# EAGLE design 0350_2Dot8inchLCDRev010002 (EAGLE 9.6.2)
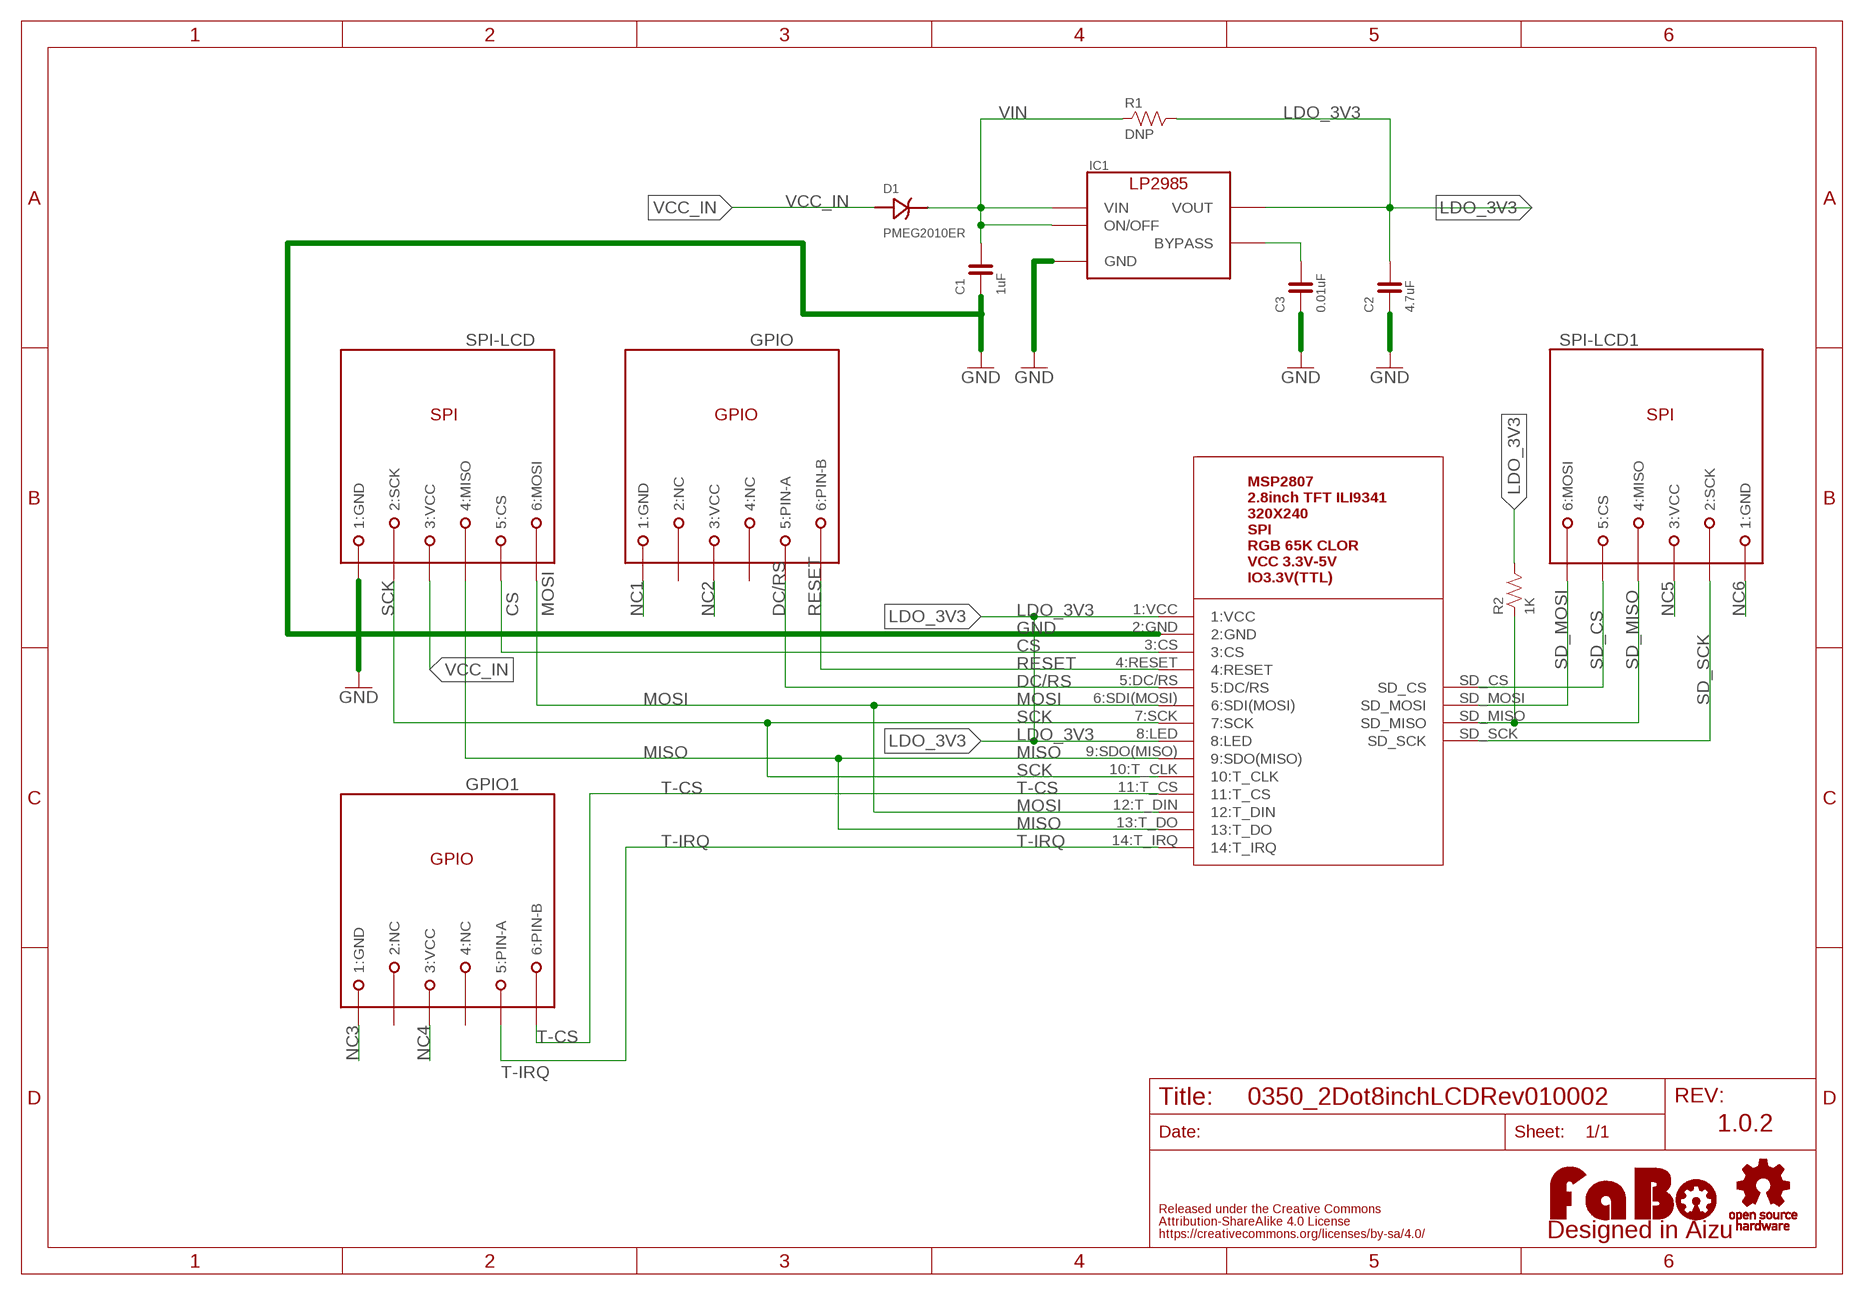
[diagram p0: schematic, sheet 1]

## Parts
C1  1uF  CAPACITOR-0603  [0603]
C2  4.7uF  CAPACITOR-0603  [0603]
C3  0.01uF  CAPACITOR-0603  [0603]
D1  PMEG2010ER  [SOD123W]
GPIO  MODULAR-JACK-6P-RJ11_GPIO  [7002-6PXC-X]
GPIO1  MODULAR-JACK-6P-RJ11_GPIO  [7002-6PXC-X]
IC1  LP2985-33DBV  [SOT-23-5]
LOGO1  LOGO_FABO-M_BOTTOM  [LOGO_FABO_M_BOTTOM]
R1  DNP  RESISTOR-0805  [0805]
R2  1K  RESISTOR-0805  [0805]
SPI-LCD  MODULAR-JACK-6P-RJ11_SPI  [7002-6PXC-X]
SPI-LCD1  MODULAR-JACK-6P-RJ11_SPI  [7002-6PXC-X]
U$3  LOGO_OSHW-M_BOTTOM  [LOGO_OSHW_M_BOTTOM]
U$6  MSP2807(LCD_SPI_WITH_SDCARD  [SPI_LCD_MSP2807]

## Nets
CS: SPI-LCD.5(5:CS) U$6.3:CS
DC/RS: GPIO.5(5:PIN-A) U$6.5:DC/RS
GND: C1.1 C2.1 C3.1 IC1.2(GND) SPI-LCD.1(1:GND) U$6.2:GND
LDO_3V3: C2.2 IC1.5(VOUT) R1.2 R2.2 U$6.1:VCC U$6.8:LED
MISO: SPI-LCD.4(4:MISO) U$6.9:SDO(MISO) U$6.13:T_DO
MOSI: SPI-LCD.6(6:MOSI) U$6.6:SDI(MOSI) U$6.12:T_DIN
N$2: C3.2 IC1.4(BYPASS)
NC1: GPIO.1(1:GND)
NC2: GPIO.3(3:VCC)
NC3: GPIO1.1(1:GND)
NC4: GPIO1.3(3:VCC)
NC5: SPI-LCD1.3(3:VCC)
NC6: SPI-LCD1.1(1:GND)
RESET: GPIO.6(6:PIN-B) U$6.4:RESET
SCK: SPI-LCD.2(2:SCK) U$6.7:SCK U$6.10:T_CLK
SD_CS: SPI-LCD1.5(5:CS) U$6.SD_CS
SD_MISO: R2.1 SPI-LCD1.4(4:MISO) U$6.SD_MISO
SD_MOSI: SPI-LCD1.6(6:MOSI) U$6.SD_MOSI
SD_SCK: SPI-LCD1.2(2:SCK) U$6.SD_SCK
T-CS: GPIO1.6(6:PIN-B) U$6.11:T_CS
T-IRQ: GPIO1.5(5:PIN-A) U$6.14:T_IRQ
VCC_IN: D1.2(ANODE) SPI-LCD.3(3:VCC)
VIN: C1.2 D1.1(CATHODE) IC1.1(VIN) IC1.3(ON/OFF) R1.1
Unconnected: GPIO1.2(2:NC) GPIO1.4(4:NC) GPIO.2(2:NC) GPIO.4(4:NC)

## Notes on the sheet
- 1.0.2

## Library data of the parts
C1-C3 = FaBo-Capacitor:CAPACITOR: CAPACITOR
D1 = FaBo-Diode:PMEG2010ER
GPIO GPIO1 = FaBo-Connetor:MODULAR-JACK-6P-RJ11_GPIO
IC1 = FaBo-Supply:LP2985: LP2985
LOGO1 = component:LOGO_FABO
R1 R2 = FaBo-Resistors:RESISTOR: RESISTOR
SPI-LCD SPI-LCD1 = FaBo-Connetor:MODULAR-JACK-6P-RJ11_SPI
U$3 = component:LOGO_OSHW
U$6 = FaBo-Boards:MSP2807(LCD_SPI_WITH_SDCARD

## Board
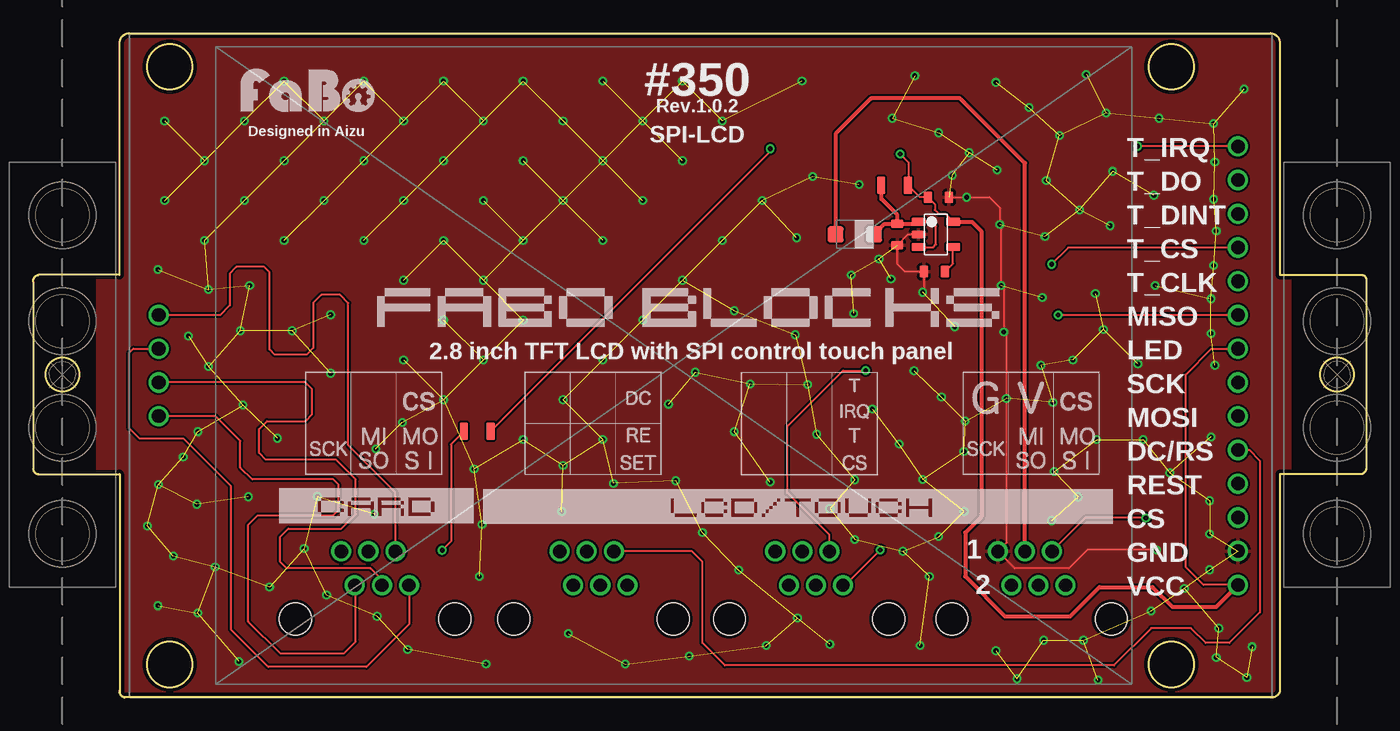
[diagram p1: board, top side]
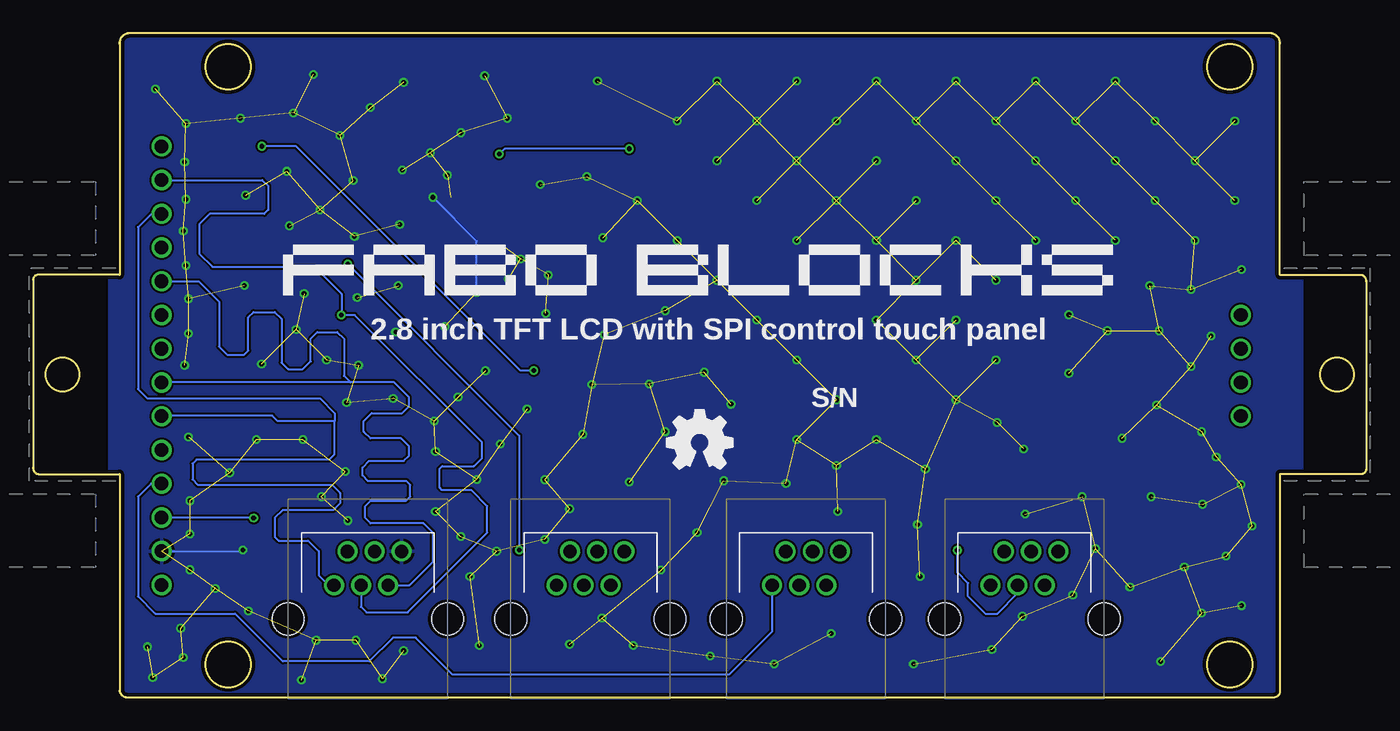
[diagram p2: board, bottom side, seen from below]

Size 100.41 x 50.01 mm. Coordinates in mm from the lower left corner, seen from the top.
Outline: 7.2,50.01 93.2,50.01 arc-90 93.9,49.21 93.9,31.81 100.1,31.81 arc-90 100.4,31.41 100.4,17.31 arc-90 100,16.81 93.9,16.81 93.9,0.51 arc-90 93.2,0.01 6.9,0.01 arc-90 6.5,0.51 6.5,16.81 0.4,16.81 arc-90 0,17.21 0,31.31 arc-90 0.4,31.81 6.5,31.81 6.5,49.21 arc-90 7.2,50.01
Outline: circle at 98.2,24.31 radius 1.27
Outline: circle at 2.2,24.31 radius 1.27
Copper layers (1*16): Top 0.035mm / dielectric 1.6mm / Bottom 0.035mm
Design rules "PCBway": minimum track width 6mil, minimum drill 12mil, track to track 6mil, track to pad 6mil, pad to pad 6mil, via to via 6mil, smd to smd 6mil, copper to edge 10mil, drill to drill 10mil, minimum pad ring 10mil, minimum via ring 6mil, stop-mask expansion 2mil, vias tented up to drill 100mil, thermal gap 8mil
tRestrict: area -1.2,15.6 to 4.7,32.7; area 94.8,15.8 to 100.7,32.9
bRestrict: area -1.2,15.6 to 4.7,32.7; area 94.8,15.8 to 100.7,32.9

### Footprints (pad centres in the part's own frame; a part is rotated, then mirrored left to right if it is on the bottom)
0603 = smd 0.65 x 0.9: 1 -0.8,0; 2 0.8,0
SOD123W = smd 1.2 x 1.2: 1 -1.45,0; 2 1.45,0
7002-6PXC-X = drill 1: 1 2.55,5.08; 2 1.53,2.54; 3 0.51,5.08; 4 -0.51,2.54; 5 -1.53,5.08; 6 -2.55,2.54 | hole 2.4: -6,0; 6,0
SOT-23-5 = smd 0.6 x 1.05: 1 -0.95,-1.3; 2 0,-1.3; 3 0.95,-1.3; 4 0.95,1.3; 5 -0.95,1.3
0805 = smd 0.6 x 1.3: 1 -1,0; 2 1,0
SPI_LCD_MSP2807 = drill 1.02: 1:VCC 0,-16.51; 2:GND 0,-13.97; 3:CS 0,-11.43; 4:RESET 0,-8.89; 5:DC/RS 0,-6.35; 6:SDI(MOSI) 0,-3.81; 7:SCK 0,-1.27; 8:LED 0,1.27; 9:SDO(MISO) 0,3.81; 10:T_CLK 0,6.35; 11:T_CS 0,8.89; 12:T_DIN 0,11.43; 13:T_DO 0,13.97; 14:T_IRQ 0,16.51; SD_CS -81.28,3.81; SD_MISO -81.28,-1.27; SD_MOSI -81.28,1.27; SD_SCK -81.28,-3.81

### Placement (x,y rotation side)
C1  65.08,34.86 90 top
C2  68.18,37.66 180 top
C3  67.88,32.06 0 top
D1  61.88,34.86 180 top
GPIO  42.2,5.91 0 bottom
GPIO1  58.44,5.91 0 bottom
IC1  67.98,34.86 270 top
LOGO1  20.67,43.71 0 bottom
R1  64.88,38.56 0 top
R2  33.45,20.04 0 top
SPI-LCD  75.2,5.91 0 bottom
SPI-LCD1  25.75,5.91 0 bottom
U$2  [4-1BLOCK]  2.2,24.31 0 top
U$3  50.2,19.19 0 top
U$4  [4-1BLOCK]  98.2,24.31 180 top
U$6  90.73,24.98 0 top

### Tracks (layer width: path | path; a pad name or v marks a point on that pad's centre or on a via)
CS  (via drill 0.35)
  Top 0.152: v83.8,13.51 79.25,13.51 SPI-LCD.5
  Bottom 0.152: U$6.3:CS 83.85,13.55 v83.8,13.51
DC/RS
  Top 0.152: U$6.5:DC/RS 91.58,18.63 92.4,17.81 92.4,6.41 90.1,4.11 88.3,4.11 87.2,5.21 84.2,5.21 81.4,2.41 52.1,2.41 50.4,4.11 50.4,10.21 49.62,10.99 GPIO.5
GND  (via drill 0.35)  (185 unrouted)
  Top 0.152: IC1.2 65.88,34.86 C1.1 65.08,32.63 65.65,32.06 C3.1 67.08,30.59 v67,30.51 | C2.1 v70.3,37.66 72,37.66 72.8,36.86 v72.8,35.61 72.9,35.51 v72.9,31.01 73.1,30.81 v73.1,27.51 73.3,27.31 v73.3,22.51 73.3,11.64 SPI-LCD.1 73.93,9.71 78,9.71 79.4,11.11 v84.6,11.11
  Bottom 0.152: U$6.2:GND 84.7,11.01 v84.6,11.11 | v67,30.51 67,34.36 v70.3,37.66
  other vias: 88.6,12.31 88.6,9.61 88.6,14.81 86.7,8.21 84.2,6.51 91.8,3.81 89.1,3.01 91.4,1.51 88.7,19.61 80.1,19.41 76.8,22.21 76.9,17.01 76.7,13.31 78.7,15.11 85.6,16.91 83.6,19.41 70.1,14.01 68.2,12.11 70.1,18.51 67,16.41 65.5,11.01 67.5,9.11 76.1,4.31 79.1,4.31 72.5,3.51 74.1,1.41 80.2,1.31 89.3,5.21 88.7,27.41 84.5,31.01 80,30.41 80.6,27.71 83.2,25.11 78.3,25.41 75.9,25.01 70.2,20.81 68.4,22.61 76,30.11 61.88,16.38 60,14.21 59,19.81 63.2,21.71 69.4,27.91 76.2,34.71 81.3,39.61 81.1,35.51 84.4,37.81 89,40.31 88.9,37.51 89.1,35.11 88.9,43.21 91.2,45.81 84.8,43.61 13.2,24.91 11.3,18.11 8.6,12.91 13.7,9.81 9.4,6.91 15.5,2.71 25.7,13.81 25.8,18.71 44.6,2.51 49.4,3.11 55.2,3.91 60,4.01 9.9,43.41 12.9,40.41 9.9,37.41 12.9,34.41 15.9,37.41 30.9,40.41 27.9,43.41 30.9,46.41 33.9,43.41 36.9,46.41 39.9,43.41 42.9,46.41 45.9,43.41 48.9,46.41 51.9,43.41 57.9,46.41 42.9,40.41 48.9,40.41 36.9,40.41 24.9,46.41 21.9,43.41 18.9,46.41 15.9,43.41 33.9,37.41 39.9,37.41 45.9,37.41 36.9,34.41 42.9,34.41 27.9,37.41 24.9,40.41 21.9,37.41 18.9,40.41 24.9,34.41 30.9,34.41 18.9,34.41 27.9,31.41 30.9,28.41 27.9,25.41 33.9,31.41 33.9,25.41 36.9,28.41 30.9,22.41 42.9,25.41 39.9,22.41 47.85,22.08 36.9,19.41 42.9,19.41 45.9,28.41 48.9,31.41 51.9,34.41 54.9,37.41 33.8,13.01 48.4,16.31 54,23.61 57.4,27.31 52.8,29.11 57.5,34.61 61.8,28.91 61.6,31.81 58.7,39.21 64.7,43.61 62.2,38.61 68.2,42.51 72.6,39.71 66.4,46.81 72.5,46.31 79.3,46.91 77.3,42.31 75,44.41 76.3,38.91 78.8,36.71 55.5,16.21 52.8,20.01 50.4,12.41 39.8,14.01 28.2,3.61 33.6,9.11 15.8,22.01 12.4,20.01 11.7,27.21 15.6,27.61 22.4,28.81 18.4,19.51 17.8,8.31 21.4,15.11 22.1,7.71 25.9,6.11 22.4,24.41 33.2,17.21 89,25.01 88.9,32.51 88.7,30.01 43.7,16.11 80.8,44.01 63.7,33.01 64.6,31.51 69.2,39.31 70.5,41.01 66.8,3.91 20.4,11.21 16.2,15.11 9.4,32.21 13.2,30.71 19.5,27.61 16.3,31.01 27.8,20.71 40.3,4.81 34.1,2.51 65.21,19.08 49.88,24.48 58.33,23.56 61.88,11.9 57.56,5.97 53.14,9.59 10.56,10.64 12.32,14.54 9.43,16.03 12.4,6.35 39.91,17.47 66.34,24.59
  pour Bottom (rank 6): -12.1,-7.79 108,-7.79 108,59.61 -12.1,59.61
  pour Top (rank 6): -7.2,-5.39 105.5,-5.39 105.5,57.11 -7.2,57.11
LDO_3V3  (via drill 0.35)
  Top 0.152: U$6.1:VCC 88.14,8.47 86.8,9.81 86.8,24.31 88.75,26.25 U$6.8:LED | 69.38,35.91 69.29,35.82 | 69.29,35.82 IC1.5 | v55.5,41.31 55.49,41.31 55.49,41.09 R2.2 | 69.29,35.82 68.7,36.41 68.2,36.41 67.9,36.71 67.9,37.14 C2.2 66.78,37.66 R1.2 65.9,38.58 65.9,40.31 v65.3,40.91 | 69.29,35.82
  Top 0.305: IC1.5 70.7,35.81 71.4,35.11 71.4,13.61 70.2,12.41 70.2,9.11 73.2,6.11 78.1,6.11 80.3,8.31 84.3,8.31 85.8,6.81 89.1,6.81 90.73,8.44 U$6.1:VCC
  Bottom 0.152: v55.5,41.31 64.9,41.31 v65.3,40.91
MISO  (via drill 0.35)
  Top 0.152: U$6.9:SDO(MISO) v77.19,28.79
  Bottom 0.152: SPI-LCD.4 75.71,6.82 75.3,6.41 72.2,6.41 66.2,12.41 66.2,14.41 67.4,15.61 69.6,15.61 69.8,15.81 69.8,17.21 69.6,17.41 67.2,17.41 66.6,18.01 66.6,19.21 76.19,28.79 v77.19,28.79 | v77.19,28.79 77.2,28.79 | 91.39,28.79 U$6.9:SDO(MISO) | U$6.13:T_DO 83.15,38.95 82.7,38.51 82.7,36.71 83,36.41 87.1,36.41 87.9,35.61 87.9,33.41 86.9,32.41 79.2,32.41 77.19,30.39 v77.19,28.79
MOSI
  Bottom 0.152: U$6.12:T_DIN 91.5,36.41 92.5,35.41 92.5,23.21 91.8,22.51 78.8,22.51 77.7,21.41 77.7,20.81 77.75,20.76 | SPI-LCD.6 78.14,8.45 78.9,9.21 78.9,11.01 79.7,11.81 81.9,11.81 82.2,12.11 82.2,13.51 81.6,14.11 77.8,14.11 77.3,14.61 77.3,15.41 77.9,16.01 88,16.01 88.4,16.41 88.4,17.61 88.1,17.91 78.1,17.91 77.7,18.31 77.7,20.71 77.75,20.76 | U$6.6:SDI(MOSI) 90.69,21.21 82.4,21.21 82,20.81 77.8,20.81 77.75,20.76
N$2
  Top 0.152: C3.2 69.28,32.66 IC1.4
RESET
  Bottom 0.152: U$6.4:RESET 91.52,16.09 92.5,15.11 92.5,7.61 91.2,6.31 85.2,6.31 84.15,5.26 81.6,2.71 75.1,2.71 73.3,4.51 71.6,4.51 68.8,1.71 48,1.71 44.75,4.96 GPIO.6
SCK
  Bottom 0.152: SPI-LCD.2 72.06,8.45 70.3,10.21 70.3,12.41 71,13.11 75,13.11 75.4,13.51 75.4,14.41 75,14.81 72.3,14.81 72,15.11 72,16.01 72.3,16.31 75.2,16.31 75.6,16.71 75.6,17.31 75.1,17.81 72.5,17.81 72.1,18.21 72.1,18.91 72.7,19.51 75,19.51 75.5,20.01 75.5,20.81 74.9,21.41 72.6,21.41 72.1,21.91 72.1,22.61 73.21,23.71 76.5,23.71 | U$6.10:T_CLK 87.93,31.33 86.4,29.81 86.4,26.41 85.8,25.81 84.5,25.81 84.2,26.11 84.2,28.61 83.8,29.01 82.2,29.01 81.7,28.51 81.7,25.21 81.2,24.71 80.1,24.71 79.5,25.31 79.5,27.01 79,27.51 77.5,27.51 77,27.01 77,24.21 76.5,23.71 | 76.5,23.71 U$6.7:SCK
SD_CS
  Top 0.152: U$6.SD_CS 14.09,28.79 14.8,29.51 14.8,31.91 15.3,32.41 17.4,32.41 17.8,32.01 17.8,26.21 18.2,25.81 20.6,25.81 21.1,26.31 21.1,29.71 21.7,30.31 23.1,30.31 23.72,29.69 23.72,18.99 27.28,15.43 SPI-LCD1.5
SD_MISO  (via drill 0.35)
  Top 0.152: SPI-LCD1.4 26.26,8.85 25.4,9.71 19.1,9.71 18.6,10.21 18.6,12.11 19.2,12.71 23.2,12.71 24.3,13.81 24.3,16.41 22.8,17.91 17.5,17.91 17,18.41 17,20.21 17.6,20.81 20.5,20.81 21,21.31 21,23.21 20.5,23.71 U$6.SD_MISO | R2.1 31.46,19.06 31.46,11.74 v30.8,11.08
  Bottom 0.152: v30.8,11.08 30.8,9.41 30,8.61 30,7.61 28.7,6.31 27.8,6.31 26.26,7.85 SPI-LCD1.4
SD_MOSI
  Top 0.152: SPI-LCD1.6 28.3,5.51 25.1,2.31 17.7,2.31 14.9,5.11 14.9,15.91 11.3,19.51 8,19.51 7.2,20.31 7.2,25.91 7.55,26.25 U$6.SD_MOSI
SD_SCK
  Top 0.152: SPI-LCD1.2 24.3,8.37 24.3,4.21 23.4,3.31 18.6,3.31 16.2,5.71 16.2,13.01 16.9,13.71 22.6,13.71 23,14.11 23,16.01 22.6,16.41 16.5,16.41 15.6,17.31 15.6,19.31 13.74,21.17 U$6.SD_SCK
T-CS  (via drill 0.35)
  Top 0.152: v76.7,32.61 77.97,33.87 U$6.11:T_CS | v63.8,11.11 61.14,8.45 GPIO1.6
  Bottom 0.152: v76.7,32.61 63.8,19.71 v63.8,11.11
T-IRQ  (via drill 0.35)
  Top 0.152: U$6.14:T_IRQ v83.19,41.49 | v62.7,24.61 61,24.61 56.8,20.41 56.8,15.41 59.97,12.24 GPIO1.5
  Bottom 0.152: v62.7,24.61 63.7,24.61 80.59,41.49 v83.19,41.49
VCC_IN
  Top 0.305: SPI-LCD.3 74.69,40.22 69.8,45.11 63.1,45.11 60.43,42.44 D1.2
VIN
  Top 0.152: C1.2 65.07,35.67 | IC1.3 67.8,33.91 68,34.11 68,35.51 67.7,35.81 IC1.1 66.54,35.67
  Top 0.305: C1.2 65.08,36.33 63.88,37.53 R1.1 | D1.1 64.13,35.66 C1.2 | C1.2 65.09,35.67 66.54,35.67

### Text on the board
tPlace: #350 | Rev.1.0.2 | Designed in Aizu | SPI-LCD | T_IRQ | T_DO | T_DINT | T_CS | T_CLK | MISO | 2.8 inch TFT LCD with SPI control touch panel | LED | SCK | MOSI | DC/RS | REST | CS | 1 | GND | 2 | VCC
bPlace: 2.8 inch TFT LCD with SPI control touch panel | S/N
Document: LCD_SPI #350 FaBo BLOKS Rev1.0.2 / 2023/02/28